# EAGLE design RC H-Bridge Ctrl (EAGLE 7.5.0)
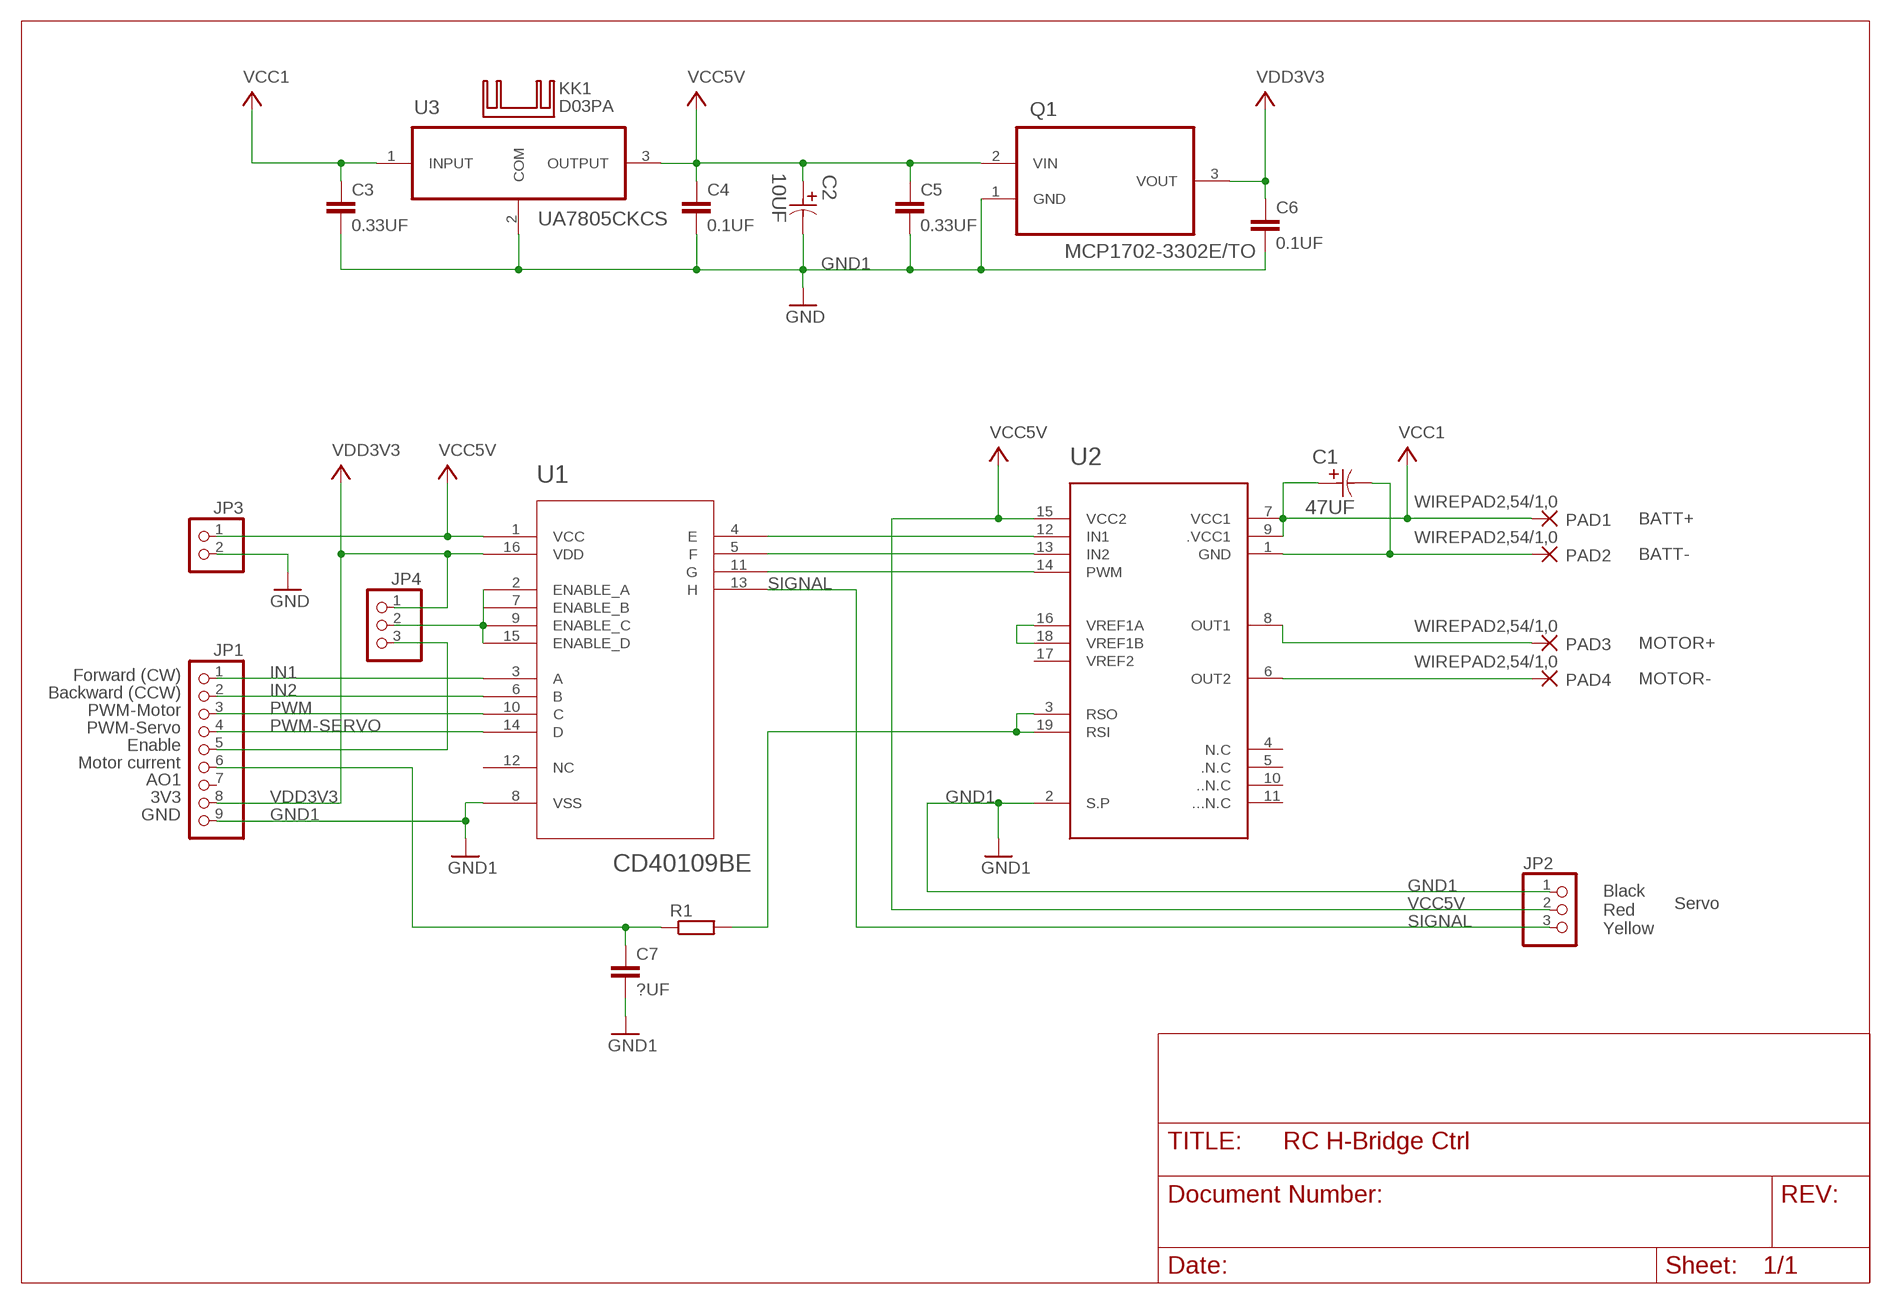
[diagram p0: schematic, sheet 1]

## Parts
C1  47UF  ECA1EHG470-D5XP2  [CAPPR200-500X1100]
C2  10UF  ECA1EM100-D5XP2  [CAPPR200-500X1100]
C3  0.33UF  C5/3  [C5B3]
C4  0.1UF  C5/3  [C5B3]
C5  0.33UF  C5/3  [C5B3]
C6  0.1UF  C5/3  [C5B3]
C7  ?UF  C5/3  [C5B3]
JP1  PINHD-1X9  [1X09]
JP2  PINHD-1X3  [1X03]
JP3  PINHD-1X2  [1X02]
JP4  PINHD-1X3  [1X03]
KK1  D03PA  [D03PA]
PAD1  WIREPAD2,54/1,0  [2,54/1,0]
PAD2  WIREPAD2,54/1,0  [2,54/1,0]
PAD3  WIREPAD2,54/1,0  [2,54/1,0]
PAD4  WIREPAD2,54/1,0  [2,54/1,0]
Q1  MCP1702-3302E/TO  [TO127P254X533-3]
R1  R-EU_0204/7  [0204/7]
U1  CD40109BE  [DIL16]
U2  STK681-360-E  [SIP-19]
U3  UA7805CKCS  [TO254P457X1016X2222-3P]

## Nets
AI0: C7.1 JP1.6 R1.1
AO0: R1.2 U2.3(RSO) U2.19(RSI)
GND1: C2.2 C3.2 C4.2 C5.2 C6.2 C7.2 JP1.9 JP2.1 JP3.2 Q1.1(GND) U1.8(VSS) U2.2(S.P) U3.2(COM) ; supply symbol labelled GND
IN1: JP1.1 U1.3(A)
IN2: JP1.2 U1.6(B)
N$1: PAD3.1(P) U2.8(OUT1)
N$2: PAD4.1(P) U2.6(OUT2)
N$3: JP4.2 U1.2(ENABLE_A) U1.7(ENABLE_B) U1.9(ENABLE_C) U1.15(ENABLE_D)
N$4: JP1.5 JP4.3
N$5: U1.4(E) U2.12(IN1)
N$6: C1.2 PAD2.1(P) U2.1(GND)
N$7: U1.5(F) U2.13(IN2)
N$8: U1.11(G) U2.14(PWM)
N$9: U2.16(VREF1A) U2.18(VREF1B)
PWM: JP1.3 U1.10(C)
PWM-SERVO: JP1.4 U1.14(D)
SIGNAL: JP2.3 U1.13(H)
VCC1: C1.1 C3.1 PAD1.1(P) U2.7(VCC1) U2.9(.VCC1) U3.1(INPUT)
VCC5V: C2.1 C4.1 C5.1 JP2.2 JP3.1 Q1.2(VIN) U1.1(VCC) U2.15(VCC2) U3.3(OUTPUT)
VDD3V3: C6.1 JP1.8 JP4.1 Q1.3(VOUT) U1.16(VDD)
Unconnected: JP1.7 U1.12(NC) U2.4(N.C) U2.5(.N.C) U2.10(..N.C) U2.11(...N.C) U2.17(VREF2)

## Notes on the sheet
- BATT+
- BATT-
- MOTOR+
- MOTOR-
- Forward (CW)
  Backward (CCW)
  PWM-Motor
  PWM-Servo
  Enable
  Motor current
  AO1
  3V3
  GND
- Black
  Red
  Yellow
- Servo

## Library data of the parts
C1 = Panasonic-ECA_01:ECA: Aluminum Electrolytic Capacitors/Radial Lead Type; MPN: ECA1EHG470; OC_FARNELL: 1848541; OC_NEWARK: 17T5002; PACKAGE: Radial Lead-TH; SUPPLIER: PANASONIC; TOLERANCE: ±20 %; VOLTAGERATING: 25V
C2 = Panasonic-ECA_01:ECA: Aluminum Electrolytic Capacitors/Radial Lead Type; MPN: ECA1EM100; OC_FARNELL: 1907125; OC_NEWARK: 58T1651; PACKAGE: Radial Lead-TH; SUPPLIER: PANASONIC; TOLERANCE: ±20 %; VOLTAGERATING: 25V
C3-C7 = capacitor-wima:C: CAPACITOR naming: grid - package width
JP1 = pinhead:PINHD-1X9: PIN HEADER
JP2 JP4 = pinhead:PINHD-1X3: PIN HEADER
JP3 = pinhead:PINHD-1X2: PIN HEADER
KK1 = heatsink:D03PA: HEATSINK distributor Schukat
PAD1-PAD4 = wirepad:WIREPAD: Wire PAD connect wire on PCB
Q1 = MCP1702-3302E-TO:MCP1702-3302E/TO: IC, V REG, LDO, 250MA; MPN: MCP1702-3302E/TO; OC_FARNELL: 1331485; OC_NEWARK: 34M7419; PACKAGE: TO-92; SUPPLIER: Microchip
R1 = resistor:R-EU_: RESISTOR, European symbol
U1 = 40xx-dil:CD40109BE: CD40109BE
U2 = stk681-360-e:STK681-360-E
U3 = TI-UA78M05CKCS:UA7805CKCS: VOLT REG, 5V, 1.5A, TO-220-3; MPN: UA7805CKCS; OC_FARNELL: 2075448; OC_NEWARK: 75M5680; PACKAGE: TO-220-3; SUPPLIER: TEXAS INSTRUMENTS

## Module STK681
Ports: 

### Library data of the parts

## Board
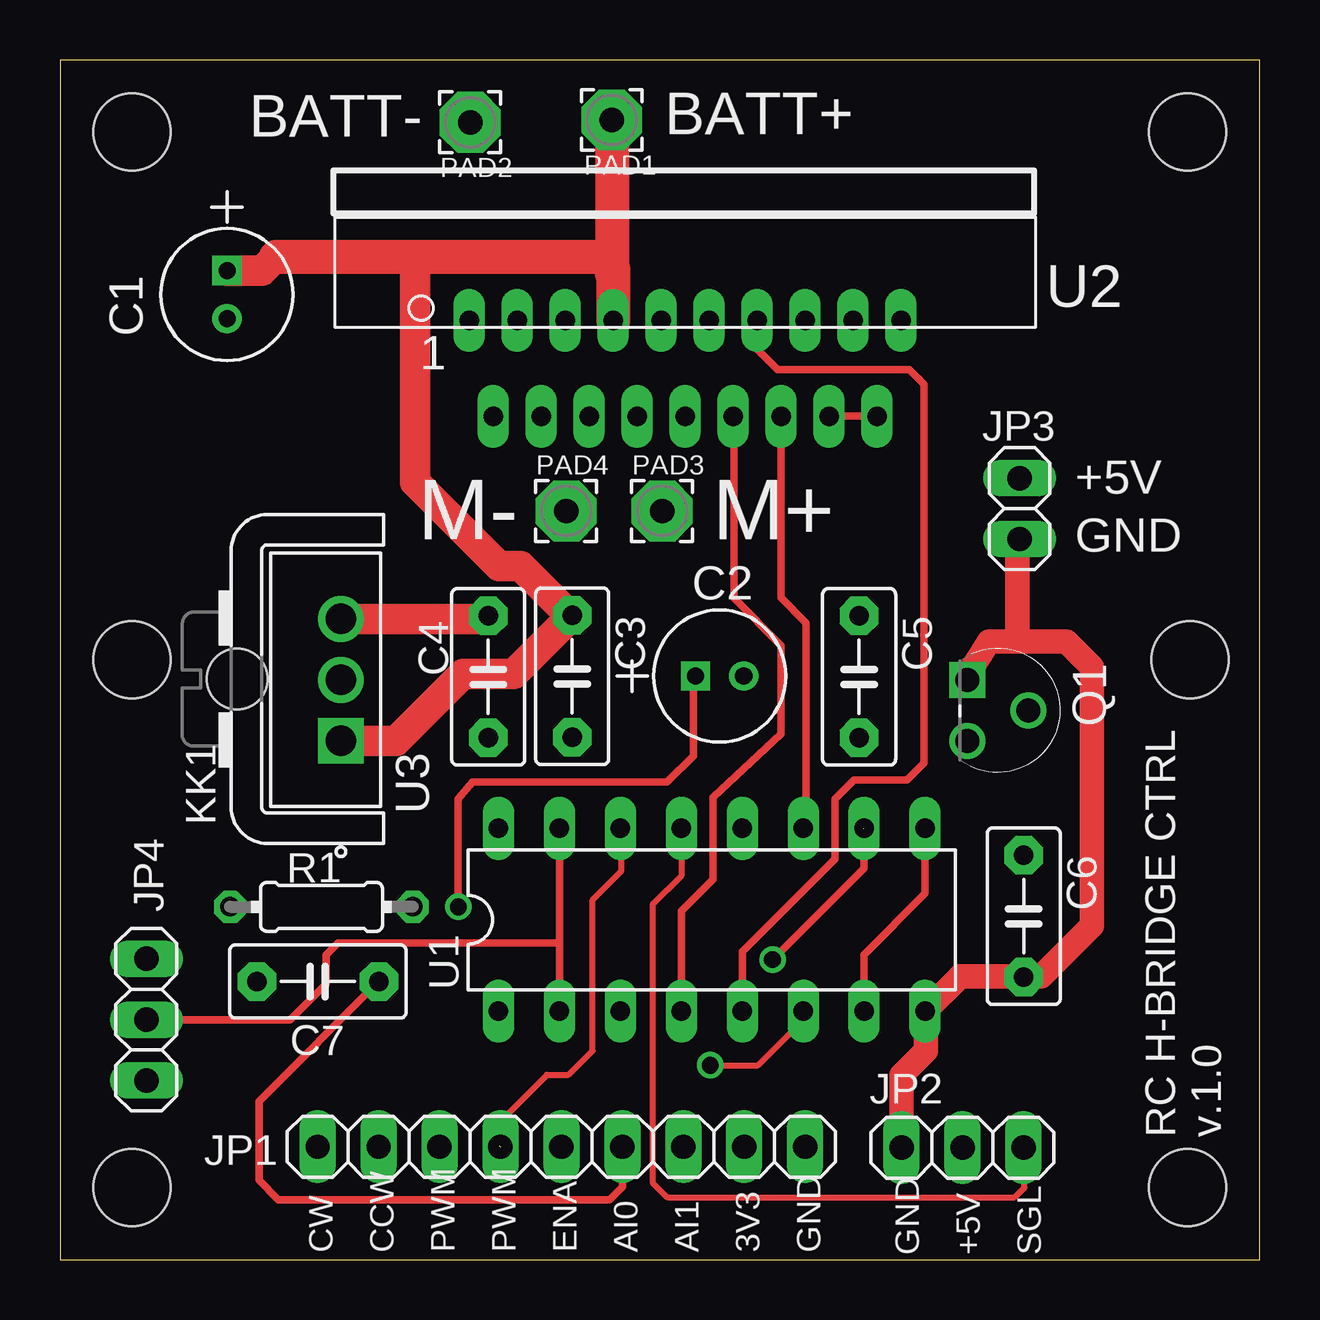
[diagram p1: board, top side]
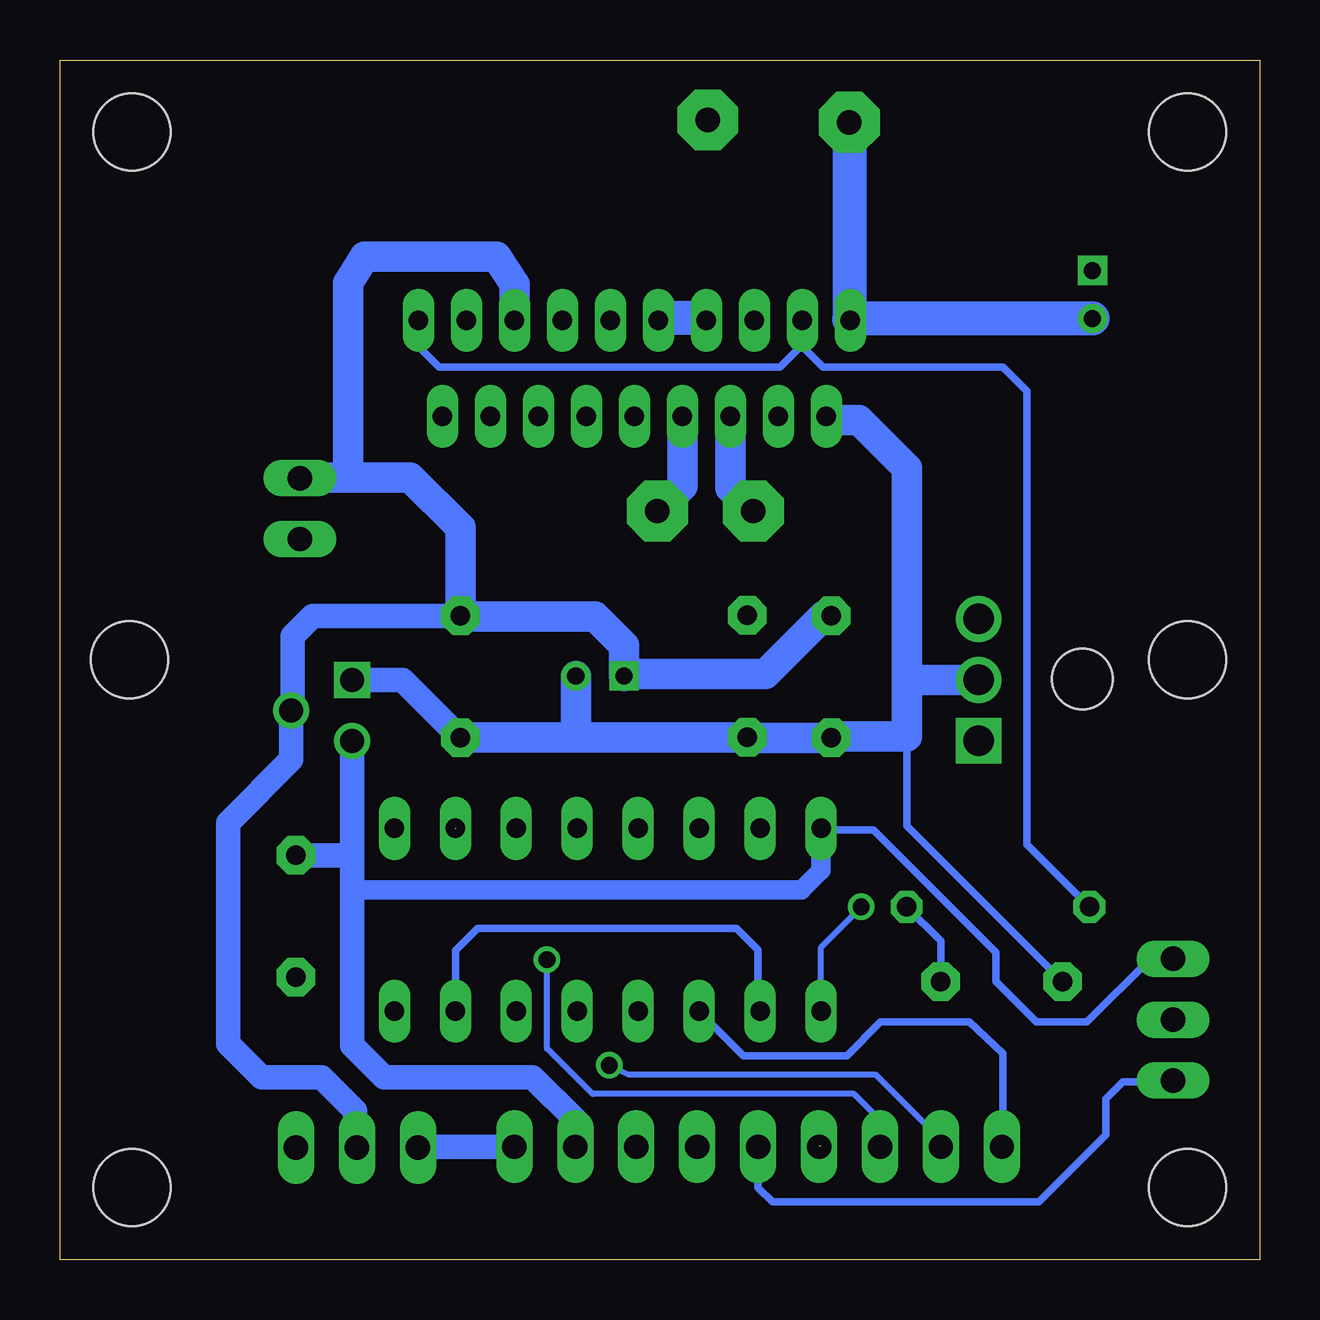
[diagram p2: board, bottom side, seen from below]

Size 50 x 50 mm. Coordinates in mm from the lower left corner, seen from the top.
Outline: 0,0 50,0 50,50 0,50 0,0
Copper layers (1*16): Top 0.035mm / dielectric 1.5mm / Bottom 0.035mm
Design rules "default": minimum track width 10mil, minimum drill 24mil, track to track 8mil, track to pad 8mil, pad to pad 8mil, via to via 8mil, smd to smd 8mil, copper to edge 40mil, drill to drill 8mil, minimum pad ring 10mil, minimum via ring 8mil, stop-mask expansion 4mil, vias tented up to drill 0mil, thermal gap 10mil
Holes 3.2 mm at 47,47 3,47 3,3 47,3 47.1,25 3,25

### Footprints (pad centres in the part's own frame; a part is rotated, then mirrored left to right if it is on the bottom)
CAPPR200-500X1100 = drill 0.711 square: 1 -2.007,0 | drill 0.711: 2 0,0
C5B3 = drill 0.813 pad 1.6 octagon: 1 -2.54,0; 2 2.54,0
1X09 = drill 1.016 long: 1 -10.16,0; 2 -7.62,0; 3 -5.08,0; 4 -2.54,0; 5 0,0; 6 2.54,0; 7 5.08,0; 8 7.62,0; 9 10.16,0
1X03 = drill 1.016 long: 1 -2.54,0; 2 0,0; 3 2.54,0
1X02 = drill 1.016 long: 1 -1.27,0; 2 1.27,0
D03PA = hole 2.54: 0,-1.016
2,54/1,0 = drill 1.016 pad 2.54 octagon: 1 0,0
TO127P254X533-3 = drill 0.991 square: 1 -2.54,-2.54 | drill 0.991: 2 -1.27,0; 3 0,-2.54
0204/7 = drill 0.813 octagon: 1 -3.81,0; 2 3.81,0
DIL16 = drill 0.813 long: 1 -8.89,-3.81; 2 -6.35,-3.81; 3 -3.81,-3.81; 4 -1.27,-3.81; 5 1.27,-3.81; 6 3.81,-3.81; 7 6.35,-3.81; 8 8.89,-3.81; 9 8.89,3.81; 10 6.35,3.81; 11 3.81,3.81; 12 1.27,3.81; 13 -1.27,3.81; 14 -3.81,3.81; 15 -6.35,3.81; 16 -8.89,3.81
SIP-19 = drill 0.8 pad 1.016 long: 1 -9,2; 2 -8,-2; 3 -7,2; 4 -6,-2; 5 -5,2; 6 -4,-2; 7 -3,2; 8 -2,-2; 9 -1,2; 10 0,-2; 11 1,2; 12 2,-2; 13 3,2; 14 4,-2; 15 5,2; 16 6,-2; 17 7,2; 18 8,-2; 19 9,2
TO254P457X1016X2222-3P = drill 1.27 square: 1 -5.08,-1.27 | drill 1.27: 2 -2.54,-1.27; 3 0,-1.27

### Placement (x,y rotation side)
C1  6.96,39.22 270 top
C2  28.5,24.32 0 top
C3  21.35,24.31 270 top
C4  17.85,24.29 270 top
C5  33.31,24.29 270 top
C6  40.17,14.31 270 top
C7  10.75,11.59 180 top
JP1  20.9,4.7 0 top
JP2  37.62,4.66 0 top
JP3  40,31.3 270 top
JP4  3.6,10 270 top
KK1  8.4,24.2 270 top
PAD1  23,47.5 0 top
PAD2  17.1,47.4 0 top
PAD3  25.1,31.2 0 top
PAD4  21.1,31.2 0 top
Q1  40.36,21.62 270 top
R1  10.9,14.7 180 top
U1  27.17,14.16 0 top
U2  26.06,37.15 0 top
U3  10.44,26.7 90 top

### Tracks (layer width: path | path; a pad name or v marks a point on that pad's centre or on a via)
AI0
  Top 0.305: JP1.6 23.44,3.04 22.9,2.5 9.1,2.5 8.3,3.3 8.3,6.6 C7.1
  Bottom 0.305: C7.1 13.29,13.28 R1.1
AO0
  Bottom 0.305: U2.19 35.1,39.11 35.1,38.1 34.2,37.2 20,37.2 19.06,38.14 U2.3 19.06,38.06 18.2,37.2 10.7,37.2 9.7,36.2 9.7,17.8 9.7,17.34 9.7,17.31 R1.2
GND1
  Top 0.254: 36.1,10.31 U1.8
  Top 0.305: C6.2 37.48,11.77 37.51,11.8
  Top 0.406: JP3.2 39.9,29.93
  Top 0.61: Q1.1 38.72,25.76
  Top 1.016: U1.8 37.48,11.77 | 37.51,11.8 40.9,11.8 43,13.9 43,24.7 41.94,25.76 39.9,25.76 | 37.9,24.46 38.72,25.76 39.9,25.76 | 36.1,10.31 36.1,8.7 35.08,7.68 JP2.1 | 39.9,29.93 39.9,25.76
  Bottom 0.305: 14.7,21.8 14.7,18.08 C7.2
  Bottom 0.813: 35.04,4.7 JP2.1
  Bottom 1.016: C5.2 35.72,24.16 Q1.1 | C4.2 17.85,21.8 | JP1.9 35.04,4.7 | 17.91,35 U2.2
  Bottom 1.27: 14.7,24.16 U3.2 | 17.85,21.8 14.7,21.8 14.7,24.16 | 14.7,24.16 14.7,33 16.7,35 17.91,35 | C4.2 21.33,21.75 C3.2 28.8,21.77 | 28.8,21.77 33.29,21.77 C5.2 | C2.2 28.5,22.07 28.8,21.77
IN1
  Bottom 0.254: JP1.1 10.7,5.4
  Bottom 0.305: 10.7,5.4 10.7,8.6 12.1,9.9 15.8,9.9 17.2,8.5 21.51,8.5 U1.3
IN2  (via drill 0.7)
  Top 0.254: v27.1,8.1 29.1,8.1 30.8,9.8 30.8,10.17 U1.6
  Bottom 0.254: JP1.2 13.68,5.38 16,7.7 26.3,7.7 v27.1,8.1
N$1
  Bottom 1.27: PAD3.1 24.06,32.24 U2.8
N$2
  Bottom 1.27: PAD4.1 22.06,32.16 U2.6
N$3
  Top 0.305: U1.9 36.06,15.26 33.5,12.7 33.5,10.37 U1.7 | U1.15 20.82,13.3 | 20.82,13.3 U1.2 | JP4.2 9.6,10 11.1,11.5 11.1,12.7 11.6,13.2 20.72,13.2 20.82,13.3
  Bottom 0.305: U1.7 33.52,12.88 32.6,13.8 21.8,13.8 20.9,12.9 20.9,10.43 U1.2
N$4
  Bottom 0.305: JP1.5 20.9,3 20.3,2.4 9.2,2.4 6.4,5.2 6.4,6.7 5.7,7.4 3.66,7.4
  Bottom 0.406: 3.66,7.4 JP4.3
N$5
  Top 0.254: 28.09,34.45 U2.12
  Top 0.305: 28.09,34.45 28.09,27.57 30.06,25.6 30.06,21.9 27.22,19.26 27.22,15.84 25.9,14.53 U1.4
N$6
  Bottom 1.27: 17.1,39.19 U2.1 16.99,39.22
  Bottom 1.422: PAD2.1 17.1,39.19 | C1.2 16.99,39.22
N$7
  Top 0.254: 29,39.09 U2.13
  Top 0.305: U1.5 28.44,12.84 32.3,16.7 32.3,19.2 33.1,20 35.3,20 36,20.7 36,36.5 35.4,37.1 29.9,37.1 29,38 29,39.09
N$8
  Top 0.254: 30.05,34.75 U2.14 | 31.1,18.17 U1.11
  Top 0.305: 30.05,34.75 30.05,27.59 31.1,26.53 31.1,18.17
N$9
  Top 0.254: 32.08,35.15 U2.16 | 33.9,35.15 U2.18
  Top 0.305: 33.9,35.15 32.08,35.15
PWM  (via drill 0.7)  (1 unrouted)
  Top 0.305: v29.7,12.5 33.5,16.3 33.5,17.95
  Bottom 0.254: JP1.3 15.82,5.82 16.9,6.9 27.8,6.9 29.7,8.8 v29.7,12.5
PWM-SERVO  (1 unrouted)
  Top 0.254: 18.3,4.74 18.3,5.7 20.3,7.7 21.2,7.7 22.2,8.7 22.2,15 23.4,16.2 23.4,17.93 U1.14
SIGNAL
  Top 0.254: U1.13 25.9,16 24.7,14.8 24.7,3.2 25.3,2.6 39.8,2.6 40.2,3 40.2,4.62 JP2.3
VCC1
  Top 1.016: 14.8,41.8 14.6,41.6 14.8,41.4 | 21.25,26.85 C3.1
  Top 1.27: C1.1 8.43,41.23 9,41.8 | 22.66,41.8 23.03,41.43 23.06,41.3 | 14.8,41.4 14.8,32.4 18.3,28.9 19.2,28.9 21.25,26.85 | U3.1 14.02,21.62 16.8,24.4 18.9,24.4 C3.1
  Top 1.422: 9,41.8 14.8,41.8 22.66,41.8 | 23.06,41.3 U2.7 | PAD1.1 23,41.1 23.03,41.43
  Bottom 0.254: 23.16,39.26 U2.7 | 24.99,39.26 U2.9
  Bottom 1.422: 24.99,39.26 23.16,39.26
VCC5V  (via drill 0.7)
  Top 0.254: 26.4,24.23 C2.1
  Top 0.305: v16.6,14.7 16.6,19.2 17.2,19.9 25.3,19.9 26.4,21 26.4,24.23
  Top 1.016: 17.72,26.7 C4.1
  Top 1.27: U3.3 17.72,26.7
  Bottom 0.254: 38,33 38.4,32.6 | U1.1 18.28,13.02 v16.6,14.7
  Bottom 0.813: 37.7,4.74 JP2.2
  Bottom 1.016: 37.7,4.74 37.7,6.2 39.1,7.6 41.6,7.6 43,9 43,18.2 40.36,20.84 Q1.2 40.3,22.95 40.3,26 39.47,26.83 C5.1 33.28,26.8 | 39.97,32.6 JP3.1 | C2.1 26.41,24.4 | C4.1 18.17,26.83
  Bottom 1.27: C5.1 33.31,30.51 35.4,32.6 38.4,32.6 39.97,32.6 | U2.15 31.06,40.66 31.8,41.8 37.3,41.8 38,40.7 38,33 | 18.17,26.83 20.6,24.4 26.41,24.4 | C2.1 26.49,25.59 27.7,26.8 33.28,26.8
VDD3V3
  Bottom 0.254: 37.62,15.4 37.82,15.2
  Bottom 0.305: JP4.1 4.56,12.54 7.2,9.9 9.3,9.9 11,11.6 11,12.8 16.1,17.9 18.21,17.9
  Bottom 0.406: 18.21,17.9 U1.16
  Bottom 0.813: 28.5,4.72 JP1.8 | 37.87,16.85 37.82,16.8 | U1.16 18.28,16.22 19.1,15.4 37.62,15.4
  Bottom 1.016: Q1.3 37.82,16.8 37.82,15.2 37.82,8.92 36.5,7.6 30.3,7.6 28.5,5.8 28.5,4.72 | C6.1 37.87,16.85

### Text on the board
tNames: BATT- | BATT+ | U2 | 1 | M- | M+ | +5V / GND | RC H-BRIDGE CTRL / v.1.0 | CW / CCW / PWM / PWM / ENA / AI0 / AI1 / 3V3 / GND | GND / +5V / SGL